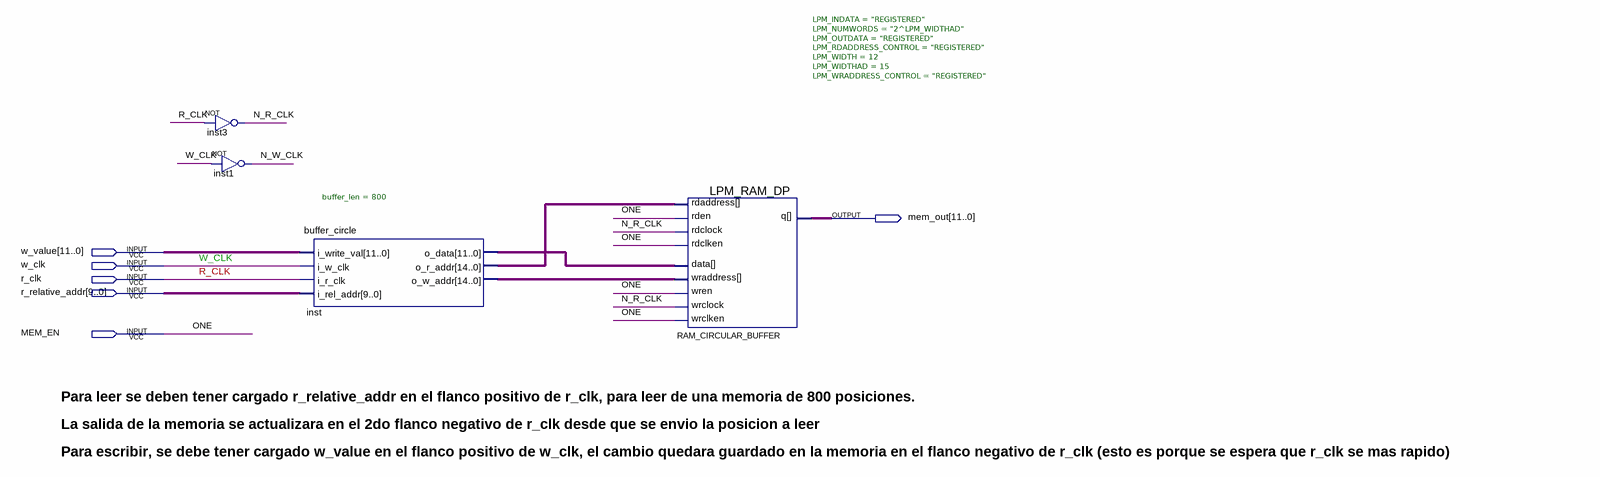
[diagram p0: schematic sheet]
// Quartus schematic GraphMemory.bdf as structural Verilog: 4 symbols, 6 pins
module GraphMemory (
  input  [11:0] w_value,
  input  w_clk,
  input  r_clk,
  input  [9:0] r_relative_addr,
  input  MEM_EN,
  output [11:0] mem_out
);

  wire N_R_CLK, N_W_CLK;
  wire [11:0] inst_o_data;
  wire [14:0] inst_o_r_addr, inst_o_w_addr;

  not inst3 (N_R_CLK, r_clk);
  not inst1 (N_W_CLK, w_clk);
  buffer_circle #(.buffer_len(800)) inst (
    .i_write_val(w_value), .i_w_clk(w_clk), .i_r_clk(r_clk), .i_rel_addr(r_relative_addr),
    .o_data(inst_o_data), .o_r_addr(inst_o_r_addr), .o_w_addr(inst_o_w_addr));
  LPM_RAM_DP #(.LPM_INDATA("REGISTERED"), .LPM_NUMWORDS("2^LPM_WIDTHAD"), .LPM_OUTDATA("REGISTERED"), .LPM_RDADDRESS_CONTROL("REGISTERED"), .LPM_WIDTH(12), .LPM_WIDTHAD(15), .LPM_WRADDRESS_CONTROL("REGISTERED")) RAM_CIRCULAR_BUFFER (
    .rden(MEM_EN), .rdclock(N_R_CLK), .rdclken(MEM_EN), .wren(MEM_EN), .wrclock(N_R_CLK), .wrclken(MEM_EN),
    .rdaddress(inst_o_r_addr), .data(inst_o_data), .wraddress(inst_o_w_addr), .q(mem_out));

  // Other names for the same wires on the sheet: ONE = MEM_EN

  // Notes on the sheet:
  //   Para leer se deben tener cargado r_relative_addr en el flanco positivo de r_clk, para leer de una memoria de 800 posiciones.
  //   La salida de la memoria se actualizara en el 2do flanco negativo de r_clk desde que se envio la posicion a leer
  //   Para escribir, se debe tener cargado w_value en el flanco positivo de w_clk, el cambio quedara guardado en la memoria en el flanco negativo de r_clk (esto es porque se espera que r_clk se mas rapido)
endmodule
